# Altium schematic sheet main.SchDoc
size A1
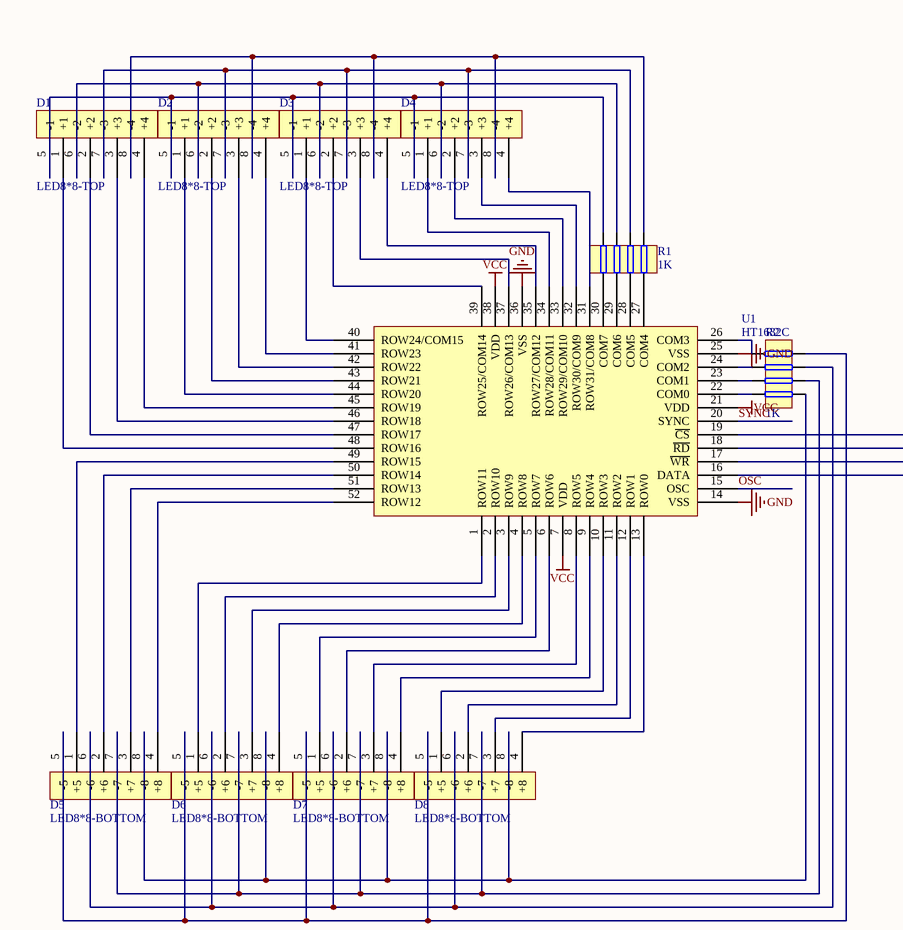
[diagram p0: main.SchDoc, top left]
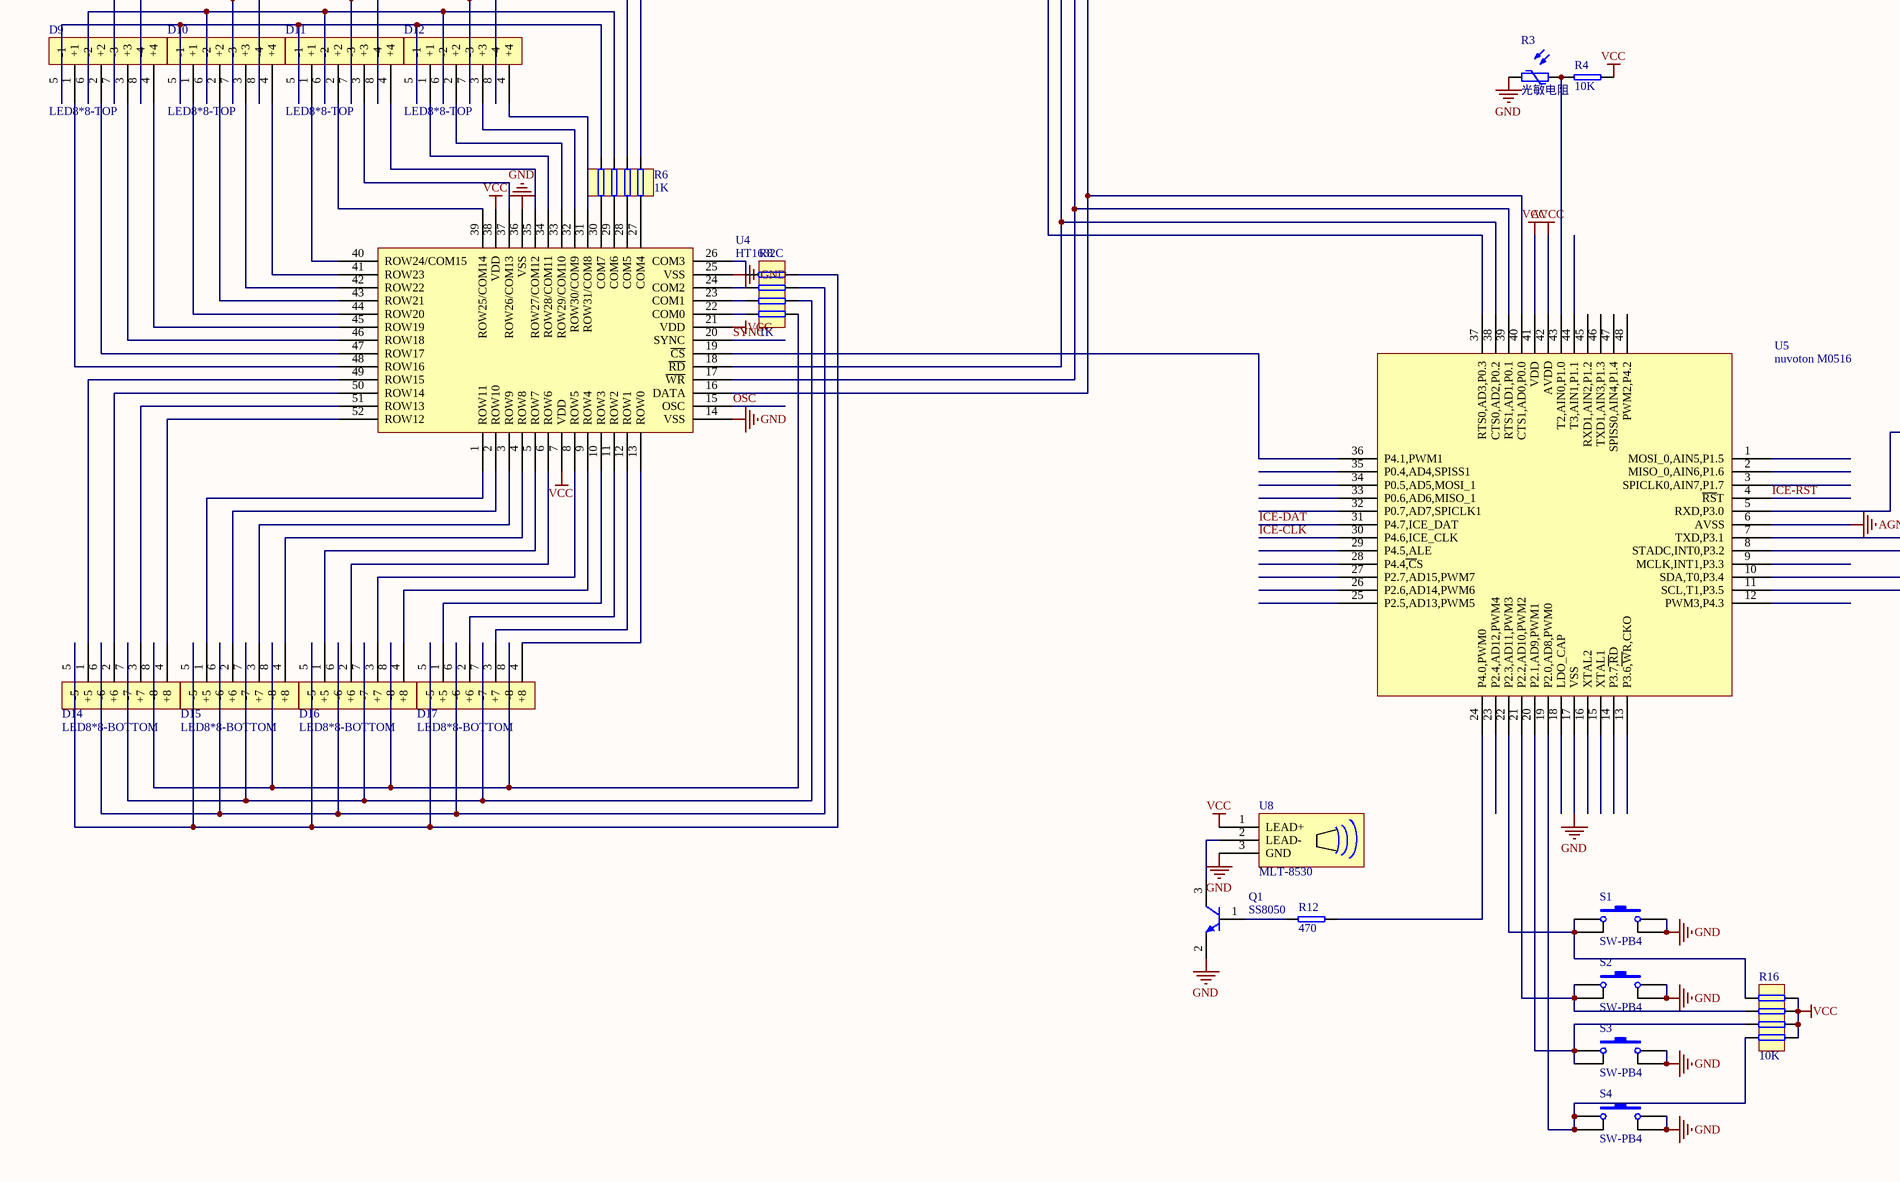
[diagram p1: main.SchDoc, bottom left]
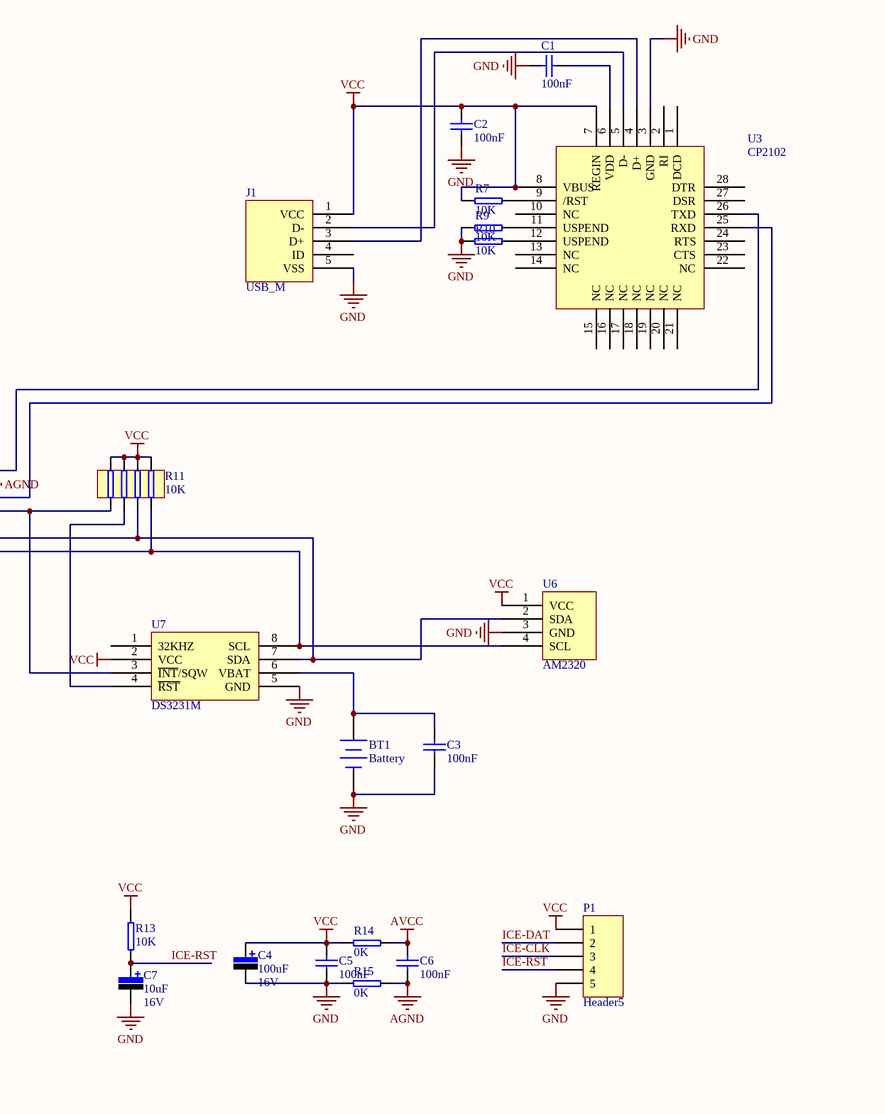
[diagram p2: main.SchDoc, bottom right]

## Parts
BT1  Battery  [CR2032-2-1]
C1  value 100nF  [C-RAD-0603]  (hidden comment: Cap)
C2  value 100nF  [C-RAD-0603]  (hidden comment: Cap)
C3  value 100nF  [C-RAD-0603]  (hidden comment: Cap)
C4  value 100uF  Vol: 16V  [CAP-3216]  (hidden comment: Cap Pol)
C5  value 100nF  [C-RAD-0603]  (hidden comment: Cap)
C6  value 100nF  [C-RAD-0603]  (hidden comment: Cap)
C7  value 10uF  Vol: 16V  [CAP-3216]  (hidden comment: Cap Pol)
D1  LED8*8-TOP  [LED8*8-half]
D2  LED8*8-TOP  [LED8*8-half]
D3  LED8*8-TOP  [LED8*8-half]
D4  LED8*8-TOP  [LED8*8-half]
D5  LED8*8-BOTTOM  [LED8*8-half]
D6  LED8*8-BOTTOM  [LED8*8-half]
D7  LED8*8-BOTTOM  [LED8*8-half]
D8  LED8*8-BOTTOM  [LED8*8-half]
D9  LED8*8-TOP  [LED8*8-half]
D10  LED8*8-TOP  [LED8*8-half]
D11  LED8*8-TOP  [LED8*8-half]
D12  LED8*8-TOP  [LED8*8-half]
D14  LED8*8-BOTTOM  [LED8*8-half]
D15  LED8*8-BOTTOM  [LED8*8-half]
D16  LED8*8-BOTTOM  [LED8*8-half]
D17  LED8*8-BOTTOM  [LED8*8-half]
J1  USB_M  [USB_MICRO]
P1  Header5  [HDR5X1_A]
Q1  SS8050  [SOT-23]
R1  1K  [RES0603ROW]
R2  1K  [RES0603ROW]
R3  光敏电阻  [RES3]
R4  value 10K  [RES_0603]  (hidden comment: Res1)
R6  1K  [RES0603ROW]
R7  value 10K  [RES_0603]  (hidden comment: Res1)
R8  1K  [RES0603ROW]
R9  value 10K  [RES_0603]  (hidden comment: Res1)
R10  value 10K  [RES_0603]  (hidden comment: Res1)
R11  10K  [RES0603ROW]
R12  value 470  [RES_0603]  (hidden comment: Res1)
R13  value 10K  [RES_0603]  (hidden comment: Res1)
R14  value 0K  [RES_0603]  (hidden comment: Res1)
R15  value 0K  [RES_0603]  (hidden comment: Res1)
R16  10K  [RES0603ROW]
S1  SW-PB4  [SW_PB4_A2_4.5*4.5]
S2  SW-PB4  [SW_PB4_A2_4.5*4.5]
S3  SW-PB4  [SW_PB4_A2_4.5*4.5]
S4  SW-PB4  [SW_PB4_A2_4.5*4.5]
U1  HT1632C  [QFP52-14mm-1.0mm]
U3  CP2102  [QFN-28]
U4  HT1632C  [QFP52-14mm-1.0mm]
U5  nuvoton M0516  [LQFP-48_7x7x05P]
U6  AM2320  [HDR4X1_A]
U7  DS3231M  [SOP-8]
U8  MLT-8530  [MLT-8530]

## Nets
AGND: C6.1 R15.2 U5.6(AVSS)
AVCC: C6.2 R14.2 U5.42(AVDD)
GND: BT1.2(-) C1.1 C2.1 C3.1 C4.2 C5.1 C7.2 J1.5(VSS) P1.5 Q1.2(E) R3.1 R9.1 R10.1 R15.1 S1.2 S1.3 S2.2 S2.3 S3.2 S3.3 S4.2 S4.3 U1.14(VSS) U1.25(VSS) U1.36(VSS) U3.3(GND) U4.14(VSS) U4.25(VSS) U4.36(VSS) U5.17(VSS) U6.3(GND) U7.5(GND) U8.3(GND)
VCC: C2.2 C4.1 C5.2 J1.1(VCC) P1.1 R4.2 R7.1 R11.5 R11.6 R11.7 R11.8 R13.2 R14.1 R16.5 R16.6 R16.7 R16.8 U1.7(VDD) U1.21(VDD) U1.38(VDD) U3.7(REGIN) U3.8(VBUS) U4.7(VDD) U4.21(VDD) U4.38(VDD) U5.41(VDD) U6.1(VCC) U7.2(VCC) U8.1(LEAD+)
ICE-CLK: P1.3 U5.30(P4.6,ICE_CLK)
ICE-DAT: P1.2 U5.31(P4.7,ICE_DAT)
ICE-RST: C7.1 P1.4 R13.1 U5.4(~{RS}T)
OSC: U1.15(OSC) U4.15(OSC)
SYNC: U1.20(SYNC) U4.20(SYNC)
NetBT1_1: BT1.1(+) C3.2 U7.6(VBAT)
NetC1_2: C1.2 U3.6(VDD)
NetD1_1: D1.1(+1) U1.48(ROW16)
NetD1_2: D1.2(+2) U1.47(ROW17)
NetD1_3: D1.3(+3) U1.46(ROW18)
NetD1_4: D1.4(+4) U1.45(ROW19)
NetD1_5: D1.5(-1) D2.5(-1) D3.5(-1) D4.5(-1) R1.8
NetD1_6: D1.6(-2) D2.6(-2) D3.6(-2) D4.6(-2) R1.7
NetD1_7: D1.7(-3) D2.7(-3) D3.7(-3) D4.7(-3) R1.6
NetD1_8: D1.8(-4) D2.8(-4) D3.8(-4) D4.8(-4) R1.5
NetD2_1: D2.1(+1) U1.44(ROW20)
NetD2_2: D2.2(+2) U1.43(ROW21)
NetD2_3: D2.3(+3) U1.42(ROW22)
NetD2_4: D2.4(+4) U1.41(ROW23)
NetD3_1: D3.1(+1) U1.40(ROW24/COM15)
NetD3_2: D3.2(+2) U1.39(ROW25/COM14)
NetD3_3: D3.3(+3) U1.37(ROW26/COM13)
NetD3_4: D3.4(+4) U1.35(ROW27/COM12)
NetD4_1: D4.1(+1) U1.34(ROW28/COM11)
NetD4_2: D4.2(+2) U1.33(ROW29/COM10)
NetD4_3: D4.3(+3) U1.32(ROW30/COM9)
NetD4_4: D4.4(+4) U1.31(ROW31/COM8)
NetD5_1: D5.1(+5) U1.49(ROW15)
NetD5_2: D5.2(+6) U1.50(ROW14)
NetD5_3: D5.3(+7) U1.51(ROW13)
NetD5_4: D5.4(+8) U1.52(ROW12)
NetD5_5: D5.5(-5) D6.5(-5) D7.5(-5) D8.5(-5) R2.8
NetD5_6: D5.6(-6) D6.6(-6) D7.6(-6) D8.6(-6) R2.7
NetD5_7: D5.7(-7) D6.7(-7) D7.7(-7) D8.7(-7) R2.6
NetD5_8: D5.8(-8) D6.8(-8) D7.8(-8) D8.8(-8) R2.5
NetD6_1: D6.1(+5) U1.1(ROW11)
NetD6_2: D6.2(+6) U1.2(ROW10)
NetD6_3: D6.3(+7) U1.3(ROW9)
NetD6_4: D6.4(+8) U1.4(ROW8)
NetD7_1: D7.1(+5) U1.5(ROW7)
NetD7_2: D7.2(+6) U1.6(ROW6)
NetD7_3: D7.3(+7) U1.8(ROW5)
NetD7_4: D7.4(+8) U1.9(ROW4)
NetD8_1: D8.1(+5) U1.10(ROW3)
NetD8_2: D8.2(+6) U1.11(ROW2)
NetD8_3: D8.3(+7) U1.12(ROW1)
NetD8_4: D8.4(+8) U1.13(ROW0)
NetD9_1: D9.1(+1) U4.48(ROW16)
NetD9_2: D9.2(+2) U4.47(ROW17)
NetD9_3: D9.3(+3) U4.46(ROW18)
NetD9_4: D9.4(+4) U4.45(ROW19)
NetD9_5: D9.5(-1) D10.5(-1) D11.5(-1) D12.5(-1) R6.8
NetD9_6: D9.6(-2) D10.6(-2) D11.6(-2) D12.6(-2) R6.7
NetD9_7: D9.7(-3) D10.7(-3) D11.7(-3) D12.7(-3) R6.6
NetD9_8: D9.8(-4) D10.8(-4) D11.8(-4) D12.8(-4) R6.5
NetD10_1: D10.1(+1) U4.44(ROW20)
NetD10_2: D10.2(+2) U4.43(ROW21)
NetD10_3: D10.3(+3) U4.42(ROW22)
NetD10_4: D10.4(+4) U4.41(ROW23)
NetD11_1: D11.1(+1) U4.40(ROW24/COM15)
NetD11_2: D11.2(+2) U4.39(ROW25/COM14)
NetD11_3: D11.3(+3) U4.37(ROW26/COM13)
NetD11_4: D11.4(+4) U4.35(ROW27/COM12)
NetD12_1: D12.1(+1) U4.34(ROW28/COM11)
NetD12_2: D12.2(+2) U4.33(ROW29/COM10)
NetD12_3: D12.3(+3) U4.32(ROW30/COM9)
NetD12_4: D12.4(+4) U4.31(ROW31/COM8)
NetD14_1: D14.1(+5) U4.49(ROW15)
NetD14_2: D14.2(+6) U4.50(ROW14)
NetD14_3: D14.3(+7) U4.51(ROW13)
NetD14_4: D14.4(+8) U4.52(ROW12)
NetD14_5: D14.5(-5) D15.5(-5) D16.5(-5) D17.5(-5) R8.8
NetD14_6: D14.6(-6) D15.6(-6) D16.6(-6) D17.6(-6) R8.7
NetD14_7: D14.7(-7) D15.7(-7) D16.7(-7) D17.7(-7) R8.6
NetD14_8: D14.8(-8) D15.8(-8) D16.8(-8) D17.8(-8) R8.5
NetD15_1: D15.1(+5) U4.1(ROW11)
NetD15_2: D15.2(+6) U4.2(ROW10)
NetD15_3: D15.3(+7) U4.3(ROW9)
NetD15_4: D15.4(+8) U4.4(ROW8)
NetD16_1: D16.1(+5) U4.5(ROW7)
NetD16_2: D16.2(+6) U4.6(ROW6)
NetD16_3: D16.3(+7) U4.8(ROW5)
NetD16_4: D16.4(+8) U4.9(ROW4)
NetD17_1: D17.1(+5) U4.10(ROW3)
NetD17_2: D17.2(+6) U4.11(ROW2)
NetD17_3: D17.3(+7) U4.12(ROW1)
NetD17_4: D17.4(+8) U4.13(ROW0)
NetJ1_2: J1.2(D-) U3.5(D-)
NetJ1_3: J1.3(D+) U3.4(D+)
NetQ1_1: Q1.1(B) R12.1
NetQ1_3: Q1.3(C) U8.2(LEAD-)
NetR1_1: R1.1 U1.30(COM7)
NetR1_2: R1.2 U1.29(COM6)
NetR1_3: R1.3 U1.28(COM5)
NetR1_4: R1.4 U1.27(COM4)
NetR2_1: R2.1 U1.26(COM3)
NetR2_2: R2.2 U1.24(COM2)
NetR2_3: R2.3 U1.23(COM1)
NetR2_4: R2.4 U1.22(COM0)
NetR3_2: R3.2 R4.1 U5.43(T2,AIN0,P1.0)
NetR6_1: R6.1 U4.30(COM7)
NetR6_2: R6.2 U4.29(COM6)
NetR6_3: R6.3 U4.28(COM5)
NetR6_4: R6.4 U4.27(COM4)
NetR7_2: R7.2 U3.9(/RST)
NetR8_1: R8.1 U4.26(COM3)
NetR8_2: R8.2 U4.24(COM2)
NetR8_3: R8.3 U4.23(COM1)
NetR8_4: R8.4 U4.22(COM0)
NetR9_2: R9.2 U3.11(USPEND)
NetR10_2: R10.2 U3.12(USPEND)
NetR11_1: R11.1 U5.8(STADC,INT0,P3.2) U7.3(~{INT}/SQW)
NetR11_2: R11.2 U7.4(~{RST})
NetR11_3: R11.3 U5.10(SDA,T0,P3.4) U6.2(SDA) U7.7(SDA)
NetR11_4: R11.4 U5.11(SCL,T1,P3.5) U6.4(SCL) U7.8(SCL)
NetR12_2: R12.2 U5.24(P4.0,PWM0)
NetR16_1: R16.1 S1.1 S1.4 U5.22(P2.3,AD11,PWM3)
NetR16_2: R16.2 S2.1 S2.4 U5.21(P2.2,AD10,PWM2)
NetR16_3: R16.3 S3.1 S3.4 U5.20(P2.1,AD9,PWM1)
NetR16_4: R16.4 S4.1 S4.4 U5.19(P2.0,AD8,PWM0)
NetU1_16: U1.16(DATA) U4.16(DATA) U5.40(CTS1,AD0,P0.0)
NetU1_17: U1.17(~{WR}) U4.17(~{WR}) U5.39(RTS1,AD1,P0.1)
NetU1_18: U1.18(~{RD}) U4.18(~{RD}) U5.38(CTS0,AD2,P0.2)
NetU1_19: U1.19(~{CS}) U5.37(RTS0,AD3,P0.3)
NetU3_25: U3.25(RXD) U5.7(TXD,P3.1)
NetU3_26: U3.26(TXD) U5.5(RXD,P3.0)
NetU4_19: U4.19(~{CS}) U5.36(P4.1,PWM1)

Not connected (* = marked no-connect by the designer): J1 4(ID); U3 1(DCD) 2(RI) 10(NC) 13(NC) 14(NC) 15(NC) 16(NC) 17(NC) 18(NC) 19(NC) 20(NC) 21(NC) 22(NC) 23(CTS) 24(RTS) 27(DSR) 28(DTR); U5 1(MOSI_0,AIN5,P1.5) 2(MISO_0,AIN6,P1.6) 3(SPICLK0,AIN7,P1.7) 9(MCLK,INT1,P3.3) 12(PWM3,P4.3) 13(P3.6~{,W}R,CKO) 14(P3.7~{,R}D) 15(XTAL1) 16(XTAL2) 18(LDO_CAP) 23(P2.4,AD12,PWM4) 25(P2.5,AD13,PWM5) 26(P2.6,AD14,PWM6) 27(P2.7,AD15,PWM7) 28(P4.4~{,C}S) 29(P4.5,ALE) 32(P0.7,AD7,SPICLK1) 33(P0.6,AD6,MISO_1) 34(P0.5,AD5,MOSI_1) 35(P0.4,AD4,SPISS1) 44(T3,AIN1,P1.1) 45(RXD1,AIN2,P1.2) 46(TXD1,AIN3,P1.3) 47(SPISS0,AIN4,P1.4) 48(PWM2,P4.2); U7 1(32KHZ)

## Library data of the parts
BT1 = Battery: 备份电池; Published: 24-Mar-1999; LatestRevisionDate: 17-Jul-2002; LatestRevisionNote: Re-released for DXP Platform.; PackageReference: BAT-2; Publisher: Altium Limited
C1-C3 C5 C6 = Cap: 无极性电容; Published: 8-Jun-2000; LatestRevisionDate: 17-Jul-2002; LatestRevisionNote: Re-released for DXP Platform.; PackageReference: RAD-0.3; Publisher: Altium Limited
C4 C7 = Cap Pol: 极性电解电容; Published: 8-Jun-2000; LatestRevisionDate: 17-Jul-2002; LatestRevisionNote: Re-released for DXP Platform.; PackageReference: RB7.6-15; Publisher: Altium Limited
D1-D4 D9-D12 = LED8*8-TOP: 8*8LED点阵上半部分
D5-D8 D14-D17 = LED8*8-BOTTOM: 8*8LED点阵下半部分
J1 = USB_M: MicroUSB接口
P1 = Header5: 接插件
Q1 = SS8050: NPN贴片三极管; Published: 8-Jun-2000; LatestRevisionDate: 15-Jan-2003; LatestRevisionNote: PCB Footprint 'BCY-W3/D4.7' replaced; DatasheetDocument: 1997; PackageDocument: Sep-1998; PackageReference: TO-92A; Publisher: Altium Limited; Code_JEDEC: TO-92A; ComponentLink1Description: Manufacturer Link; ComponentLink1URL: http://www.fairchildsemi.com/; ComponentLink2Description: Datasheet; ComponentLink2URL: http://www.fairchildsemi.com/ds/2N%2F2N3904.pdf
R1 R2 R6 R8 R11 R16 = Res Row: 排阻0603*4
R3 = res3
R4 R7 R9 R10 R12-R15 = Res1: 贴片电阻; Published: 8-Jun-2000; LatestRevisionDate: 17-Jul-2002; LatestRevisionNote: Re-released for DXP Platform.; PackageReference: AXIAL-0.4; Publisher: Altium Limited
S1-S4 = SW-PB4: 微动开关; Published: 24-Mar-1999; LatestRevisionDate: 17-Jul-2002; LatestRevisionNote: Re-released for DXP Platform.; PackageReference: SPST-2; Publisher: Altium Limited
U1 U4 = HT1632C: 32×8 & 24×16 LED 驱动芯片
U3 = CP2102: USB转TTL芯片
U5 = nuvoton M0516: 新唐M0516单片机
U6 = AM2320: 温湿度传感器
U7 = DS3231M: 实时时钟
U8 = MLT-8530: 贴片蜂鸣器